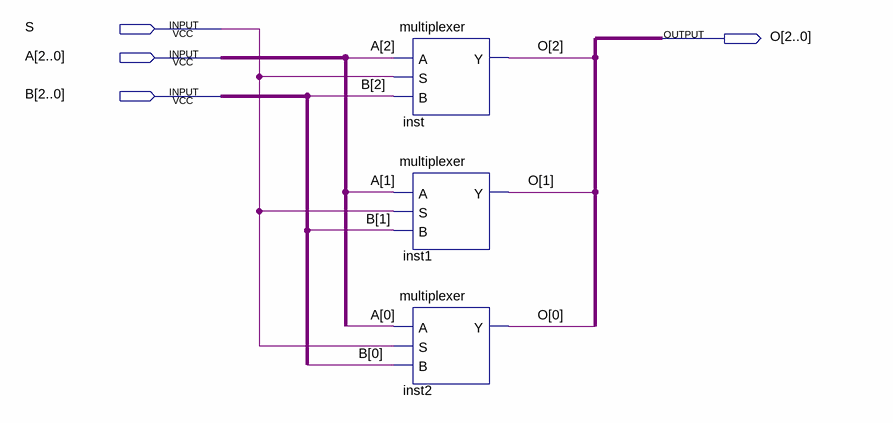
[diagram p0: schematic sheet]
// Quartus schematic threebitmulti.bdf as structural Verilog: 3 symbols, 4 pins
module threebitmulti (
  input  S,
  input  [2:0] A,
  input  [2:0] B,
  output [2:0] O
);

  multiplexer inst (.A(A[2]), .S(S), .B(B[2]), .Y(O[2]));
  multiplexer inst1 (.A(A[1]), .S(S), .B(B[1]), .Y(O[1]));
  multiplexer inst2 (.A(A[0]), .S(S), .B(B[0]), .Y(O[0]));
endmodule
